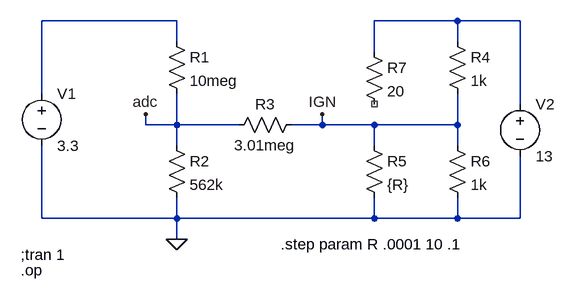
[diagram p0: schematic Cont1Net.asc]
Cont1Net.asc, the LTspice schematic file:
Version 4
SHEET 1 1220 680
WIRE 160 0 -48 0
WIRE 592 0 464 0
WIRE 688 0 592 0
WIRE 160 32 160 0
WIRE 592 32 592 0
WIRE 464 48 464 0
WIRE -48 112 -48 0
WIRE 688 128 688 0
WIRE 112 160 112 144
WIRE 160 160 160 112
WIRE 160 160 112 160
WIRE 256 160 160 160
WIRE 384 160 384 144
WIRE 384 160 336 160
WIRE 464 160 384 160
WIRE 592 160 592 112
WIRE 592 160 464 160
WIRE 160 192 160 160
WIRE 464 192 464 160
WIRE 592 192 592 160
WIRE -48 304 -48 192
WIRE 160 304 160 272
WIRE 160 304 -48 304
WIRE 464 304 464 272
WIRE 464 304 160 304
WIRE 592 304 592 272
WIRE 592 304 464 304
WIRE 688 304 688 208
WIRE 688 304 592 304
WIRE 160 336 160 304
FLAG 160 336 0
FLAG 112 144 adc
FLAG 384 144 IGN
SYMBOL voltage -48 96 R0
WINDOW 123 0 0 Left 2
WINDOW 39 0 0 Left 2
SYMATTR InstName V1
SYMATTR Value 3.3
SYMBOL res 144 16 R0
SYMATTR InstName R1
SYMATTR Value 10meg
SYMBOL res 144 176 R0
SYMATTR InstName R2
SYMATTR Value 562k
SYMBOL res 352 144 R90
WINDOW 0 0 56 VBottom 2
WINDOW 3 32 56 VTop 2
SYMATTR InstName R3
SYMATTR Value 3.01meg
SYMBOL voltage 688 112 R0
WINDOW 123 0 0 Left 2
WINDOW 39 0 0 Left 2
SYMATTR InstName V2
SYMATTR Value 13
SYMBOL res 448 176 R0
SYMATTR InstName R5
SYMATTR Value {R}
SYMBOL res 576 16 R0
SYMATTR InstName R4
SYMATTR Value 1k
SYMBOL res 576 176 R0
SYMATTR InstName R6
SYMATTR Value 1k
SYMATTR SpiceLine tol=1% pwr=.25
SYMBOL res 448 32 R0
SYMATTR InstName R7
SYMATTR Value 20
TEXT -80 360 Left 2 !;tran 1
TEXT 320 344 Left 2 !.step param R .0001 10 .1
TEXT -80 384 Left 2 !.op

The netlist it stands for:
* Cont1Net.asc
V1 N001 0 3.3
R1 N001 adc 10meg
R2 adc 0 562k
R3 IGN adc 3.01meg
V2 N002 0 13
R5 IGN 0 {R}
R4 N002 IGN 1k
R6 IGN 0 1k tol=1% pwr=.25
R7 N002 NC_01 20
;tran 1
.step param R .0001 10 .1
.op
.backanno
.end